# EasyEDA Pro project ProPrj_STM32课程设计_杨凯景_2024-12-15(1).epro

# Schematic Schematic1
Board Name: Board1; Create Date: 2024-12-06; Page Name: P1; Project Name: STM32课程设计_杨凯景; Schematic Name: Schematic1; Update Date: 2024-12-08; Company: 嘉立创EDA; Page Size: A4; Version: V1.0
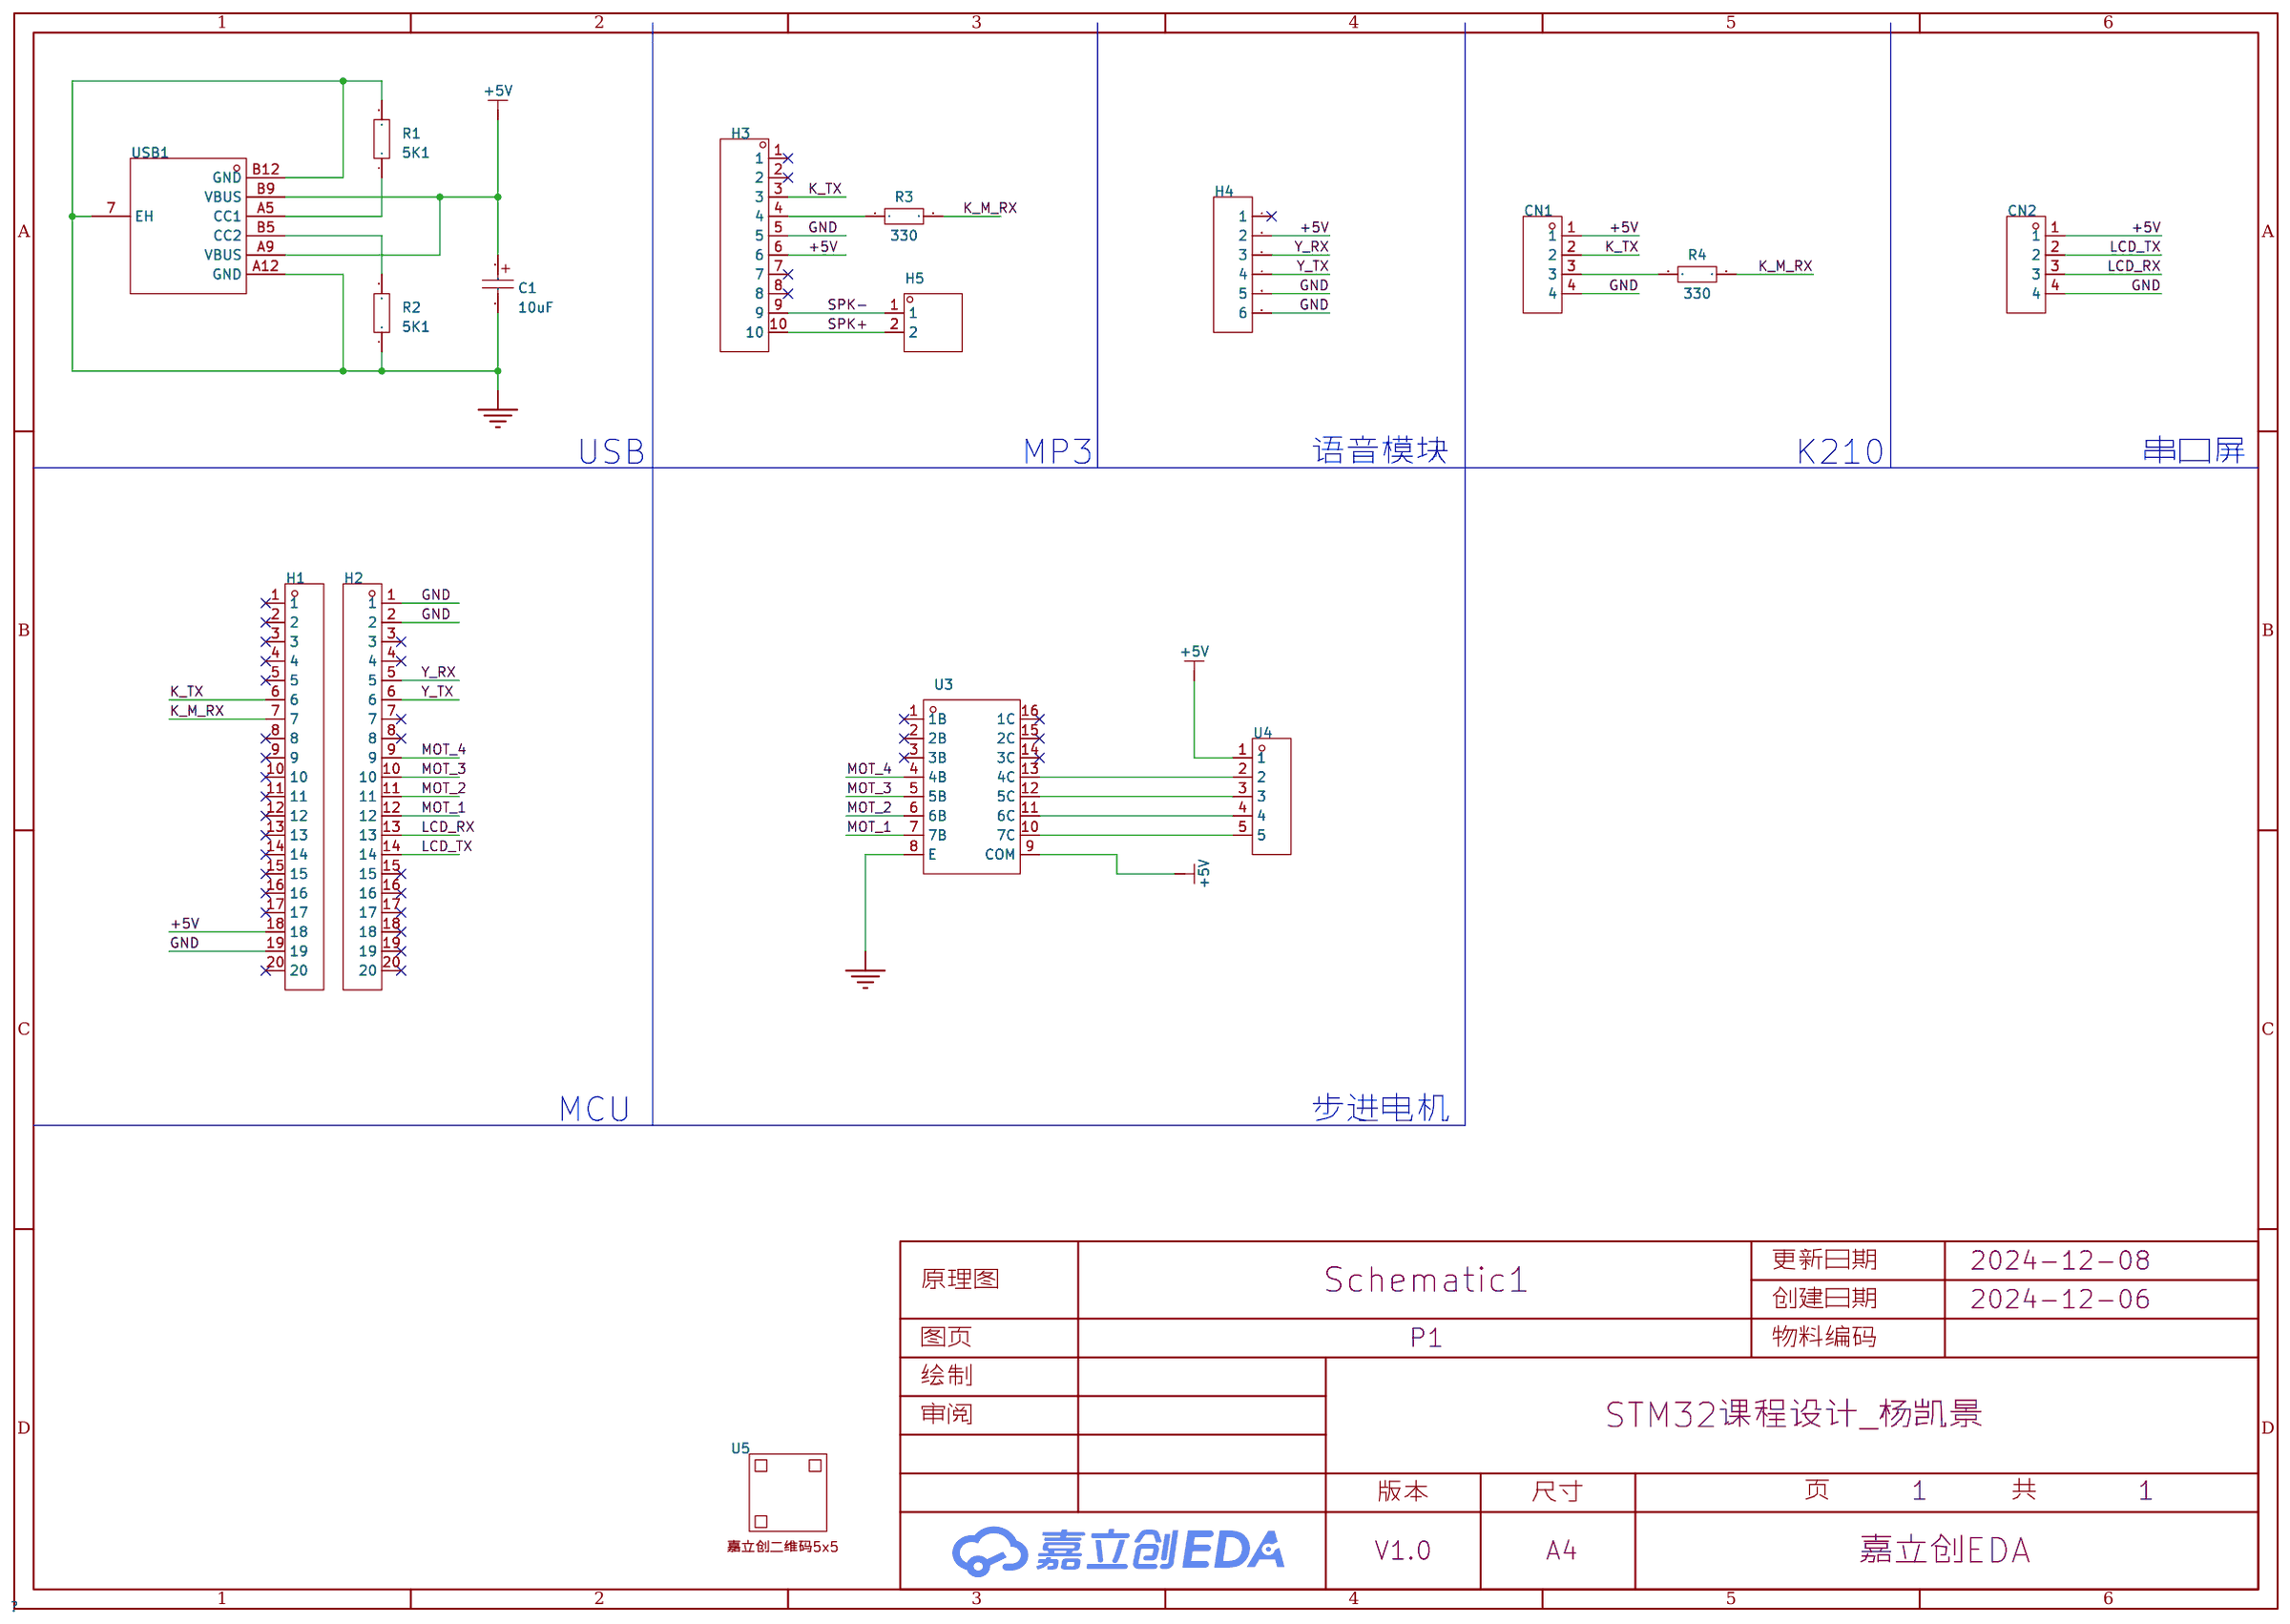
[diagram p0: schematic sheet]

## Parts
C1  10uF  [C_Ele_SMD_4x5.5mm]
CN1  ZX-XH2.54-4PZZ  [CONN-TH_4P-P2.50_4PIN]
CN2  ZX-XH2.54-4PZZ  [CONN-TH_4P-P2.50_4PIN]
H1  -  [HDR-TH_20P-P2.54-V-M-1]
H2  -  [HDR-TH_20P-P2.54-V-M-1]
H3  -  [HDR-TH_10P-P2.54-V-M-1]
H4  -  [HDR-TH_6P-P2.54-V-M-1]
H5  -  [HDR-TH_2P-P2.54-V-M-1]
R1  5K1  [R0603]
R2  5K1  [R0603]
R3  330  [R0603]
R4  330  [R0603]
U3  ULN2003AN(XBLW)  [PDIP-16_L19.3-W6.4-P2.54-LS7.9-BL]
U4  ZX-XH2.54-5PZZ  [CONN-TH_5P-P2.50_ZX-XH2.54-5PZZ]
U5  -  [JLC-QRCODE-5x5]
USB1  TYPE-C 6P(073)  [TYPE-C-SMD_TYPE-C-6P_5]

## Library data of the parts
C1 = C_Ele_SMD_4x5.5mm: Supplier Footprint: SMD,4x5.5mm
CN1 CN2 = ZX-XH2.54-4PZZ: 插针结构:1x4P;间距:2.54mm;安装方式:直插;参考系列:XH;总PIN数:4P;排数:1;每排PIN数:4;行距:-;额定电流:3A;触头材质:黄铜;触头镀层:锡;工作温度范围:-25℃~+85℃;; Supplier Part: C7429634; Manufacturer: Megastar(兆星); Supplier Footprint: 插件,P=2.5mm; JLCPCB Part Class: 扩展库; Datasheet: https://atta.szlcsc.com/upload/public/pdf/source/20230619/B529A2163E0159A644AB3383D208FB03.pdf; Supplier: LCSC; Pins Structure: 1x4P; Pitch: 2.54mm; Mounting Style: 直插; Reference Series: XH; Number of Pins: 4P; Number of Rows: 1; Number of PINs Per Row: 4; Current Rating (Max): 3A; Contact Material: 黄铜; Contact Plating: 锡; Operating Temperature Range: -25℃~+85℃
H1 H2 = HDR-M_2.54_1x20P: 间距:2.54mm;总PIN位数:20;排数:1;插针结构:-;行距:-;安装类型:直插;圆针/方针:-;额定电流:-;额定电压:-;配合针长度:-;塑高:-;触头材质:黄铜;触头镀层:-;颜色:黑色;; Supplier Part: C50981; Supplier Footprint: 插件
H3 = HDR-M_2.54_1x10P: Supplier Part: C57369; Supplier Footprint: 插件
H4 = HDR-M_2.54_1x6P: Supplier Part: C37208; Supplier Footprint: 插件
H5 = HDR-M_2.54_1x2P: Supplier Part: C124375; Supplier Footprint: 插件
R1-R4 = Res_0603: Supplier Footprint: 0603
U3 = ULN2003AN(XBLW): 通道数:七路;集射击穿电压(Vceo):50V;集电极电流(Ic):500mA;; LCSC Part Name: ULN2003AN; Supplier Part: C18723564; Manufacturer: XBLW(芯伯乐); Supplier Footprint: DIP-16; JLCPCB Part Class: 扩展库; Datasheet: https://atta.szlcsc.com/upload/public/pdf/source/20231019/22F8F93322B5FF07ABFBC6FEC2294FE2.pdf; Supplier: LCSC; number of channels: 七路; Maximum collector Emitter Voltage (Vceo): 50V; Collector Current(Ic): 500mA; maximum input voltage: 30V; Operating Temperature: -40℃~+85℃
U4 = ZX-XH2.54-5PZZ: 插针结构:1x5P;间距:2.54mm;安装方式:直插;参考系列:XH;总PIN数:5P;排数:1;每排PIN数:5;行距:-;额定电流:3A;触头材质:黄铜;触头镀层:锡;工作温度范围:-25℃~+85℃;; Supplier Part: C7429635; Manufacturer: Megastar(兆星); Supplier Footprint: 插件,P=2.54mm; JLCPCB Part Class: 扩展库; Datasheet: https://atta.szlcsc.com/upload/public/pdf/source/20230619/60EEF4ADD558E90BFFACF5D939816781.pdf; Supplier: LCSC; Pins Structure: 1x5P; Pitch: 2.54mm; Mounting Style: 直插; Reference Series: XH; Number of Pins: 5P; Number of Rows: 1; Number of PINs Per Row: 5; Current Rating (Max): 3A; Contact Material: 黄铜; Contact Plating: 锡; Operating Temperature Range: -25℃~+85℃
U5 = 嘉立创二维码5x5
USB1 = TYPE-C 6P(073): 连接器类型:Type-C;标准:USB 3.1;公母:母;安装方式:卧贴;触点数量:6P;端口数量:1;额定电流 - 电源:3A;工作温度范围:-25℃~+85℃;; LCSC Part Name: Type-C 母 卧贴; Supplier Part: C668623; Manufacturer: SHOU HAN(首韩); Supplier Footprint: SMD; JLCPCB Part Class: 扩展库; Datasheet: https://atta.szlcsc.com/upload/public/pdf/source/20200618/C668623_A4B260DED7AC1949BAC6AE39E9F4CD80.pdf; Supplier: LCSC; Connector Type: Type-C; Standard: USB 3.1; Gender: 母; Mounting Style: 卧贴; Number of Contacts: 6P; Number of Ports: 1; Current Rating - Power (Max): 3A; Operating Temperature Range: -25℃~+85℃; Rated Voltage (Max): 5V; Connect-Disconnect Life: 1万次; Core Colour: 黑色

## Nets
+5V: C1.1 CN1.1 CN2.1 H1.18 H3.6 H4.2 U3.9(COM) U4.1 USB1.A9(VBUS) USB1.B9(VBUS)
GND: C1.2 CN1.4 CN2.4 H1.19 H2.1 H2.2 H3.5 H4.5 H4.6 R1.2 R2.1 U3.8(E) USB1.7(EH) USB1.A12(GND) USB1.B12(GND)
K_M_RX: H1.7 R3.2 R4.2
K_TX: CN1.2 H1.6 H3.3
LCD_RX: CN2.3 H2.13
LCD_TX: CN2.2 H2.14
MOT_1: H2.12 U3.7(7B)
MOT_2: H2.11 U3.6(6B)
MOT_3: H2.10 U3.5(5B)
MOT_4: H2.9 U3.4(4B)
SPK+: H3.10 H5.2
SPK-: H3.9 H5.1
Y_RX: H2.5 H4.3
Y_TX: H2.6 H4.4
$CN1_3: CN1.3 R4.1
$H3_4: H3.4 R3.1
$R1_1: R1.1 USB1.A5(CC1)
$R2_2: R2.2 USB1.B5(CC2)
$U3_10: U3.10(7C) U4.5
$U3_11: U3.11(6C) U4.4
$U3_12: U3.12(5C) U4.3
$U3_13: U3.13(4C) U4.2

Not connected (* = marked no-connect by the designer): H1 1* 2* 3* 4* 5* 8* 9* 10* 11* 12* 13* 14* 15* 16* 17* 20*; H2 3* 4* 7* 8* 15* 16* 17* 18* 19* 20*; H3 1* 2* 7* 8*; H4 1*; U3 1(1B)* 2(2B)* 3(3B)* 14(3C)* 15(2C)* 16(1C)*

## Notes on the sheet
- USB
- MP3
- 语音模块
- K210
- 串口屏
- MCU
- 步进电机

# Board PCB1
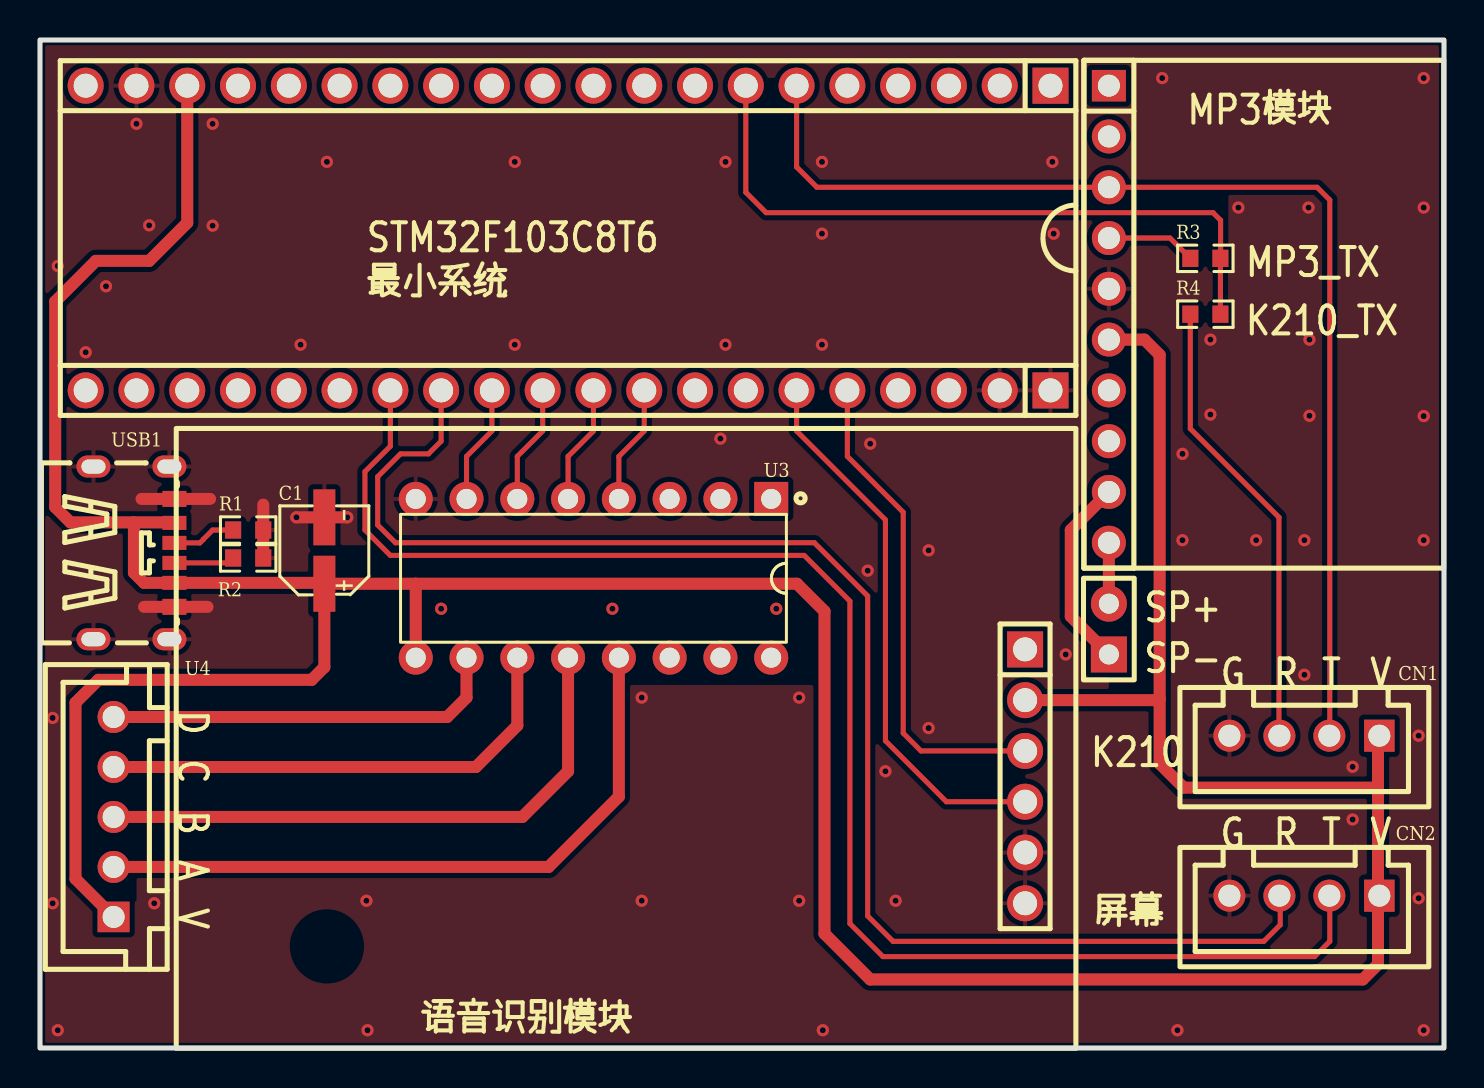
[diagram p1: board, top side]
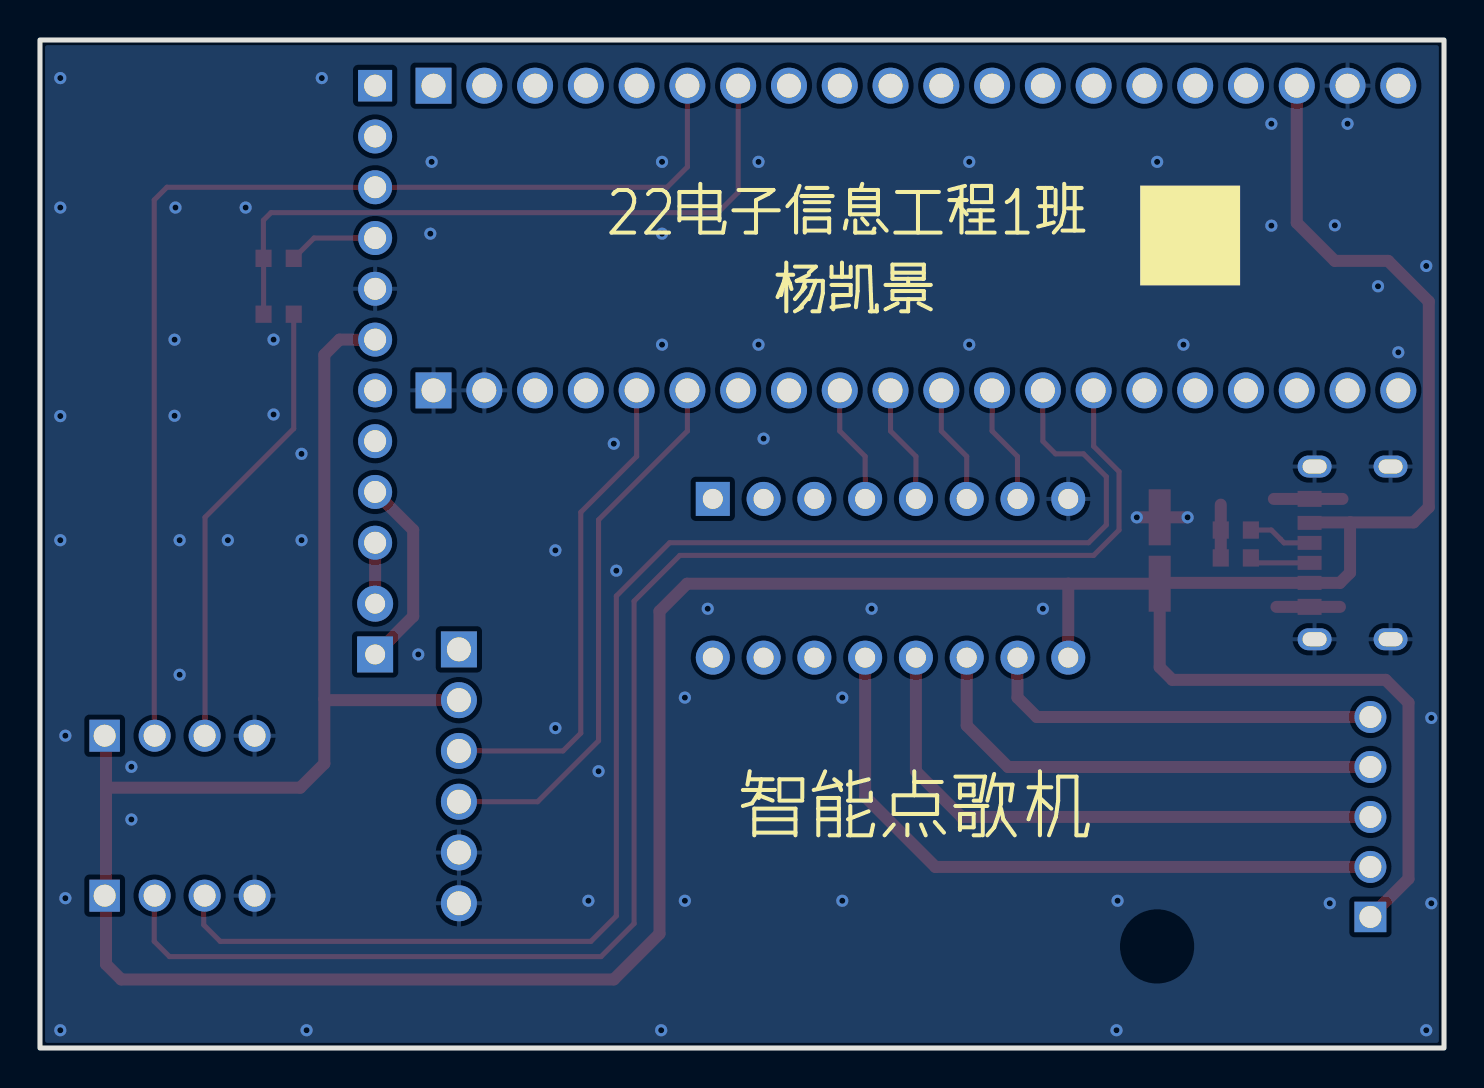
[diagram p2: board, bottom side, seen from below]

Outline 70.23 x 50.42 mm; copper layers: Top Layer, Bottom Layer. Coordinates in mm from the lower left corner of the outline.
Outline path: rectangle 0,50.42 70.23,0
Stack: Top Layer 0.035mm / Dielectric1 1.51mm FR4 er 4.5 / Bottom Layer 0.035mm

## Design rules (mm)
template: JLCPCB Capability(Two Layers Board)
spacing copperThickness1oz (default): track to track 0.102, other pairs 0.152 to 0.3
spacing copperThickness2oz: track to track 0.203, other pairs 0.152 to 0.3
track width copperThickness1oz (default): min 0.127, default 0.254, max 2.54
track width copperThickness2oz: min 0.203, default 0.254, max 2.54
differential pair differentialPair (default): width min 0.127, default 0.254, max 2.54; gap min 0.152, default 0.152
via viaSize (default): diameter min 0.5, default 0.61, max 10; hole min 0.3, default 0.305, max 6.3

## Placement (name value [footprint] x y rotation side)
C1  10uF  [C_Ele_SMD_4x5.5mm]  14.22 24.77 90 top
CN1  ZX-XH2.54-4PZZ  [CONN-TH_4P-P2.50_4PIN]  63.25 15.62 180 top
CN2  ZX-XH2.54-4PZZ  [CONN-TH_4P-P2.50_4PIN]  63.25 7.62 180 top
H1  -  [HDR-TH_20P-P2.54-V-M-1]  26.42 48.13 180 top
H2  -  [HDR-TH_20P-P2.54-V-M-1]  26.42 32.89 180 top
H3  -  [HDR-TH_10P-P2.54-V-M-1]  53.47 36.7 270 top
H4  -  [HDR-TH_6P-P2.54-V-M-1]  49.28 13.59 270 top
H5  -  [HDR-TH_2P-P2.54-V-M-1]  53.47 20.96 90 top
R1  5K1  [R0603]  10.41 25.91 0 top
R2  5K1  [R0603]  10.41 24.51 180 top
R3  330  [R0603]  58.29 39.5 0 top
R4  330  [R0603]  58.29 36.7 0 top
U3  ULN2003AN(XBLW)  [PDIP-16_L19.3-W6.4-P2.54-LS7.9-BL]  27.69 23.5 180 top
U4  ZX-XH2.54-5PZZ  [CONN-TH_5P-P2.50_ZX-XH2.54-5PZZ]  3.68 11.56 90 top
U5  -  [JLC-QRCODE-5x5]  12.7 40.64 180 bottom
USB1  TYPE-C 6P(073)  [TYPE-C-SMD_TYPE-C-6P_5]  4.7 24.77 270 top

## Footprints (pads in the part's own frame, mm; a bottom-side part is the same pattern mirrored in y, then rotated)
C_Ele_SMD_4x5.5mm
  rect 2.8x1.1 smd: 1(-1.543,0) 2(1.778,0)
CONN-TH_4P-P2.50_4PIN
  rect 1.524x1.6 hole 1.1: 1(-3.75,0)
  round 1.6 hole 1.1: 2(-1.25,0) 3(1.25,0) 4(3.75,0)
CONN-TH_5P-P2.50_ZX-XH2.54-5PZZ
  rect 1.524x1.6 hole 1.1: 1(-5,0)
  round 1.6 hole 1.1: 2(-2.5,0) 3(0,0) 4(2.5,0) 5(5,0)
HDR-TH_2P-P2.54-V-M-1
  rect 1.8x1.8 hole 1: 1(-1.27,0)
  round 1.8 hole 1: 2(1.27,0)
HDR-TH_6P-P2.54-V-M-1
  rect 1.8x1.8 hole 1.2: 1(-6.35,0)
  round 1.8 hole 1.2: 2(-3.81,0) 3(-1.27,0) 4(1.27,0) 5(3.81,0) 6(6.35,0)
HDR-TH_10P-P2.54-V-M-1
  rect 1.575x1.7 hole 1.1: 1(-11.43,0)
  round 1.7 hole 1.1: 2(-8.89,0) 3(-6.35,0) 4(-3.81,0) 5(-1.27,0) 6(1.27,0) 7(3.81,0) 8(6.35,0) 9(8.89,0) 10(11.43,0)
HDR-TH_20P-P2.54-V-M-1
  rect 1.8x1.8 hole 1.2: 1(-24.13,0)
  round 1.8 hole 1.2: 2(-21.59,0) 3(-19.05,0) 4(-16.51,0) 5(-13.97,0) 6(-11.43,0) 7(-8.89,0) 8(-6.35,0) 9(-3.81,0) 10(-1.27,0) 11(1.27,0) 12(3.81,0) 13(6.35,0) 14(8.89,0) 15(11.43,0) 16(13.97,0) 17(16.51,0) 18(19.05,0) 19(21.59,0) 20(24.13,0)
PDIP-16_L19.3-W6.4-P2.54-LS7.9-BL
  rect 1.7x1.7 hole 1: 1(-8.89,-3.97)
  round 1.7 hole 1: 2(-6.35,-3.97) 3(-3.81,-3.97) 4(-1.27,-3.97) 5(1.27,-3.97) 6(3.81,-3.97) 7(6.35,-3.97) 8(8.89,-3.97) 9(8.89,3.97) 10(6.35,3.97) 11(3.81,3.97) 12(1.27,3.97) 13(-1.27,3.97) 14(-3.81,3.97) 15(-6.35,3.97) 16(-8.89,3.97)
R0603
  rect 0.806x0.864 smd: 1(-0.753,0) 2(0.753,0)
TYPE-C-SMD_TYPE-C-6P_5
  oval 1.1x1.7 hole 0.7x1.2: 7(-4.32,1.775) 7(-4.32,-2.025) 7(4.32,1.775) 7(4.32,-2.025)
  rect 0.7x1.2 smd: A5(-0.5,2.025) A9(1.5,2.025) B5(0.5,2.025) B9(-1.5,2.025)
  rect 0.8x1.2 smd: A12(2.7,2.025) B12(-2.7,2.025)

## Nets
As in the schematic.

Pads without a net: H1 1 2 3 4 5 8 9 10 11 12 13 14 15 16 17 20; H2 3 4 7 8 15 16 17 18 19 20; H3 1 2 7 8; H4 1; U3 1 2 3 14 15 16

## Via types
v1: diameter 0.61, hole 0.305, Top Layer to Bottom Layer, 64 vias

## Routing (per net, layer and track width the routed paths; a pad name or vN(x,y) marks a point on that pad's centre or on a via; arc(x,y) is an arc through that point)
+5V: length 200.1
  Top Layer w0.6: U4.1 1.78,8.46 1.78,17.27 2.92,18.42 13.59,18.42 14.22,19.05 C1.1 ; 66.93,13.02 57.21,13.02 56.01,14.22 56.01,17.46 ; 66.93,13.02 66.93,4.19 66.17,3.43 41.53,3.43 39.24,5.72 39.24,21.84 37.87,23.22 18.8,23.22 ; 66.93,13.02 66.93,15.55 CN1.1 ; C1.1 18.8,23.22 ; C1.1 14.18,23.27 USB1.A9 5.21,23.27 4.7,23.77 4.7,26.28 4.69,26.29 ; 56.01,17.46 55.95,17.4 H4.2 ; 56.01,17.46 56.01,34.67 55.25,35.43 H3.6 ; 18.8,23.22 U3.9 ; 4.69,26.29 1.52,26.29 0.76,27.05 0.76,37.34 2.79,39.37 5.46,39.37 7.37,41.28 H1.18 ; 4.69,26.29 6.7,26.29 USB1.B9
GND: length 11.8
  Top Layer w0.6: v1(12.83,26.54) C1.2 v1(15.37,26.54) ; R2.1 R1.2 11.17,27.18 ; 5.08,27.47 USB1.B12 8.51,27.47 ; 8.38,22.07 USB1.A12 5.21,22.07
  vias: v1(0.64,16.51) v1(0.64,7.24) v1(0.89,39.12) v1(0.89,0.89) v1(2.29,34.8) v1(3.3,38.1) v1(4.83,46.23) v1(5.46,41.15) v1(5.72,7.24) v1(8.64,46.23) v1(8.64,41.13) v1(13.03,35.18) v1(14.35,44.32) v1(16.33,7.37) v1(16.38,0.89) v1(20.07,21.97) v1(23.75,44.32) v1(23.75,35.18) v1(28.63,21.97) v1(30.1,17.53) v1(30.1,7.37) v1(34.04,30.48) v1(34.29,44.32) v1(34.29,35.18) v1(36.83,21.97) v1(37.97,17.53) v1(37.97,7.37) v1(39.12,44.32) v1(39.12,40.73) v1(39.12,35.18) v1(39.16,0.89) v1(41.4,23.88) v1(41.53,30.23) v1(42.29,13.84) v1(42.8,7.37) v1(44.45,24.89) v1(44.45,16) v1(50.64,44.32) v1(50.71,40.73) v1(51.31,19.69) v1(56.13,48.51) v1(56.9,0.89) v1(57.15,25.4) v1(57.15,29.72) v1(58.55,35.43) v1(58.55,31.69) v1(59.94,42.04) v1(60.83,25.4) v1(63.25,25.4) v1(63.25,18.67) v1(63.45,42.04) v1(63.5,35.43) v1(63.5,31.62) v1(65.66,14.07) v1(65.66,11.43) v1(68.96,15.62) v1(68.96,7.49) v1(69.22,48.51) v1(69.22,42.04) v1(69.22,31.61) v1(69.22,25.4) v1(69.22,0.89)
$CN1_3: length 22.9
  Top Layer w0.254: CN1.3 61.98,15.64 61.98,26.54 57.54,30.98 R4.1
$H3_4: length 4.5
  Top Layer w0.254: R3.1 56.52,40.51 H3.4
$R1_1: length 3.2
  Top Layer w0.254: R1.1 8.64,25.91 8.18,25.45 8.18,25.44 8,25.27 USB1.A5
$R2_2: length 3
  Top Layer w0.254: USB1.B5 9.41,24.27 R2.2
$U3_10: length 20.1
  Top Layer w0.6: U3.10 21.34,17.53 20.37,16.56 U4.5
$U3_11: length 24.4
  Top Layer w0.6: U4.4 21.8,14.06 23.88,16.13 U3.11
$U3_12: length 29.4
  Top Layer w0.6: U3.12 26.42,13.84 24.13,11.56 U4.3
$U3_13: length 33.7
  Top Layer w0.6: U3.13 28.96,12.57 25.44,9.06 U4.2
K_M_RX: length 34.4
  Top Layer w0.254: H1.7 35.31,42.8 36.32,41.78 58.67,41.78 59.06,41.4 59.06,39.51 R3.2 R4.2
K_TX: length 58.2
  Top Layer w0.254: H1.6 37.85,44.07 38.86,43.05 H3.3 63.88,43.05 64.52,42.42 64.52,15.64 CN1.2
LCD_RX: length 73.8
  Top Layer w0.254: CN2.3 62.04,7.58 62.04,6.16 61.21,5.33 42.67,5.33 41.4,6.6 41.4,22.61 38.74,25.27 17.78,25.27 16.89,26.16 16.89,28.58 18.03,29.72 19.43,29.72 20.07,30.35 H2.13
LCD_TX: length 76.8
  Top Layer w0.254: 64.52,7.62 64.62,7.62 ; H2.14 17.53,30.1 16.26,28.83 16.26,25.91 17.53,24.64 38.23,24.64 40.51,22.35 40.51,6.22 42.16,4.57 63.75,4.57 64.52,5.33 64.52,7.6 CN2.2
MOT_1: length 6
  Top Layer w0.254: H2.12 22.61,30.86 21.34,29.59 U3.7
MOT_2: length 6
  Top Layer w0.254: H2.11 25.15,30.86 23.88,29.59 U3.6
MOT_3: length 6
  Top Layer w0.254: H2.10 27.69,30.86 26.42,29.59 U3.5
MOT_4: length 6
  Top Layer w0.254: H2.9 30.23,30.86 28.96,29.59 U3.4
SPK+: length 3
  Top Layer w0.6: H5.2 H3.10
SPK-: length 9.7
  Top Layer w0.6: H5.1 51.56,21.59 51.56,25.91 H3.9
Y_RX: length 24.8
  Top Layer w0.254: H2.5 40.39,29.59 43.18,26.8 43.18,15.75 44.07,14.86 H4.3
Y_TX: length 27.6
  Top Layer w0.254: H4.4 45.34,12.32 42.29,15.37 42.29,26.42 37.85,30.86 H2.6

## Copper pours and planes (outline as drawn; the poured copper is in the pictures)
GND on Top Layer: 0,50.42 70.23,50.42 70.23,0 0,0
GND on Bottom Layer: 0,50.42 70.23,50.42 70.23,0 0,0

## Text on the board
Bottom Silkscreen Layer: 杨凯景 | 22电子信息工程1班 | 智能点歌机
Top Silkscreen Layer: K210 | SP+ | SP- | G | MP3_TX | K210_TX | R | T | V | D | C | A | B | 屏幕 | 语音识别模块 | STM32F103C8T6 / 最小系统 | MP3模块
